# EAGLE schematic top (EAGLE 7.2.0)
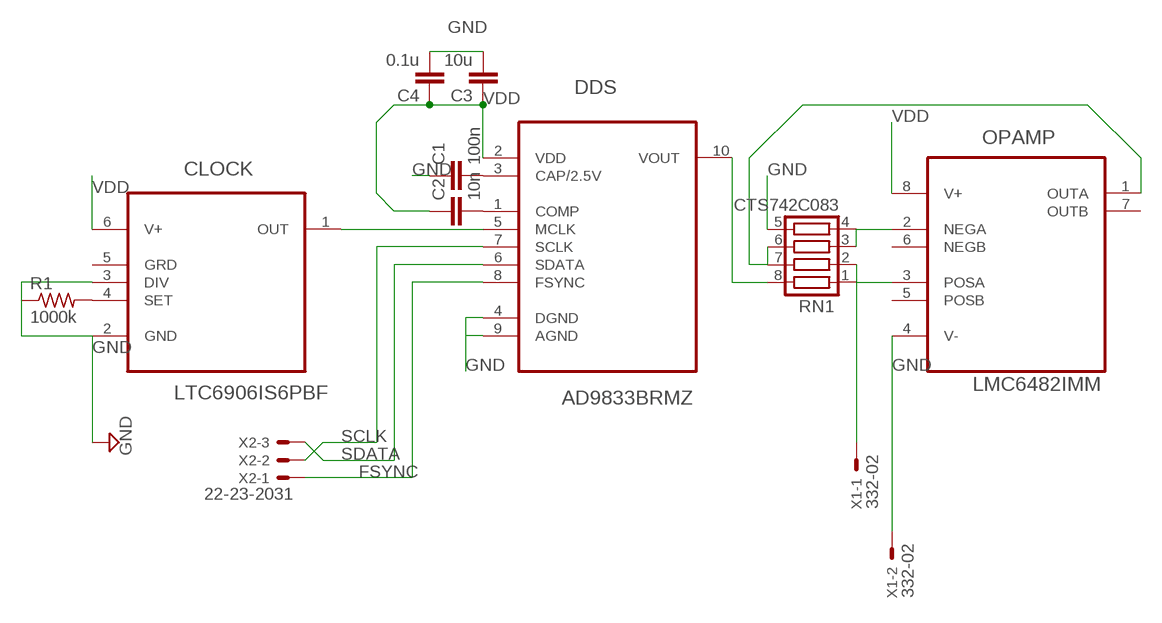
[diagram p0: schematic, sheet 1]

## Parts
C1  100n  C-EUC0805  [C0805]
C2  10n  C-EUC0805  [C0805]
C3  10u  C-EUC0805  [C0805]
C4  0.1u  C-EUC0805  [C0805]
CLOCK  LTC6906IS6PBF  [SOT95P280X100-6N]
DDS  AD9833BRMZ  [SOP50P490X110-10N]
OPAMP  LMC6482IMM  [SOP65P490X109-8N]
R1  1000k  R-US_M0805  [M0805]
RN1  CTS742C083  [CTS742C083]
X1  332-02  [332-02]
X2  22-23-2031  [22-23-2031]

## Nets
FSYNC: DDS.8(FSYNC) X2.1
GND: C1.1 C3.2 C4.2 CLOCK.2(GND) CLOCK.3(DIV) DDS.4(DGND) DDS.9(AGND) OPAMP.4(V-) R1.1 RN1.5 X1.2
N$1: C1.2 DDS.3(CAP/2.5V)
N$2: C2.2 DDS.1(COMP)
N$3: OPAMP.2(NEGA) RN1.3 RN1.4
N$4: CLOCK.1(OUT) DDS.5(MCLK)
N$5: OPAMP.3(POSA) RN1.1 RN1.2 X1.1
N$6: DDS.10(VOUT) RN1.8
N$7: OPAMP.1(OUTA) RN1.6 RN1.7
N$8: CLOCK.4(SET) R1.2
SCLK: DDS.7(SCLK) X2.2
SDATA: DDS.6(SDATA) X2.3
VDD: C2.1 C3.1 C4.1 CLOCK.6(V+) DDS.2(VDD) OPAMP.8(V+)
Unconnected: CLOCK.5(GRD) OPAMP.5(POSB) OPAMP.6(NEGB) OPAMP.7(OUTB)

## Library data of the parts
C1-C4 = resistor:C-EU: CAPACITOR, European symbol
CLOCK = LTC6906:LTC6906IS6PBF: Micropower, 10kHz to 1MHz Resistor Set Oscillator in SOT-23; MPN: LTC6906IS6#PBF; OC_FARNELL: 1432109; OC_NEWARK: 10R6975; PACKAGE: TSOT-23-6; SUPPLIER: Linear Technology
DDS = ad9833:AD9833BRMZ: Low Power 12.65 mW, 2.3 V to 5.5 V,Low Power 12.65 mW, 2.3 V to 5.5 V,Low Power 12.65 mW, 2.3 V to 5.5 V,Programmable Waveform Generator; MPN: AD9833BRMZ; OC_FARNELL: 1581966; OC_NEWARK: 19M1014; PACKAGE: MSOP-10; SUPPLIER: Analog Devices
OPAMP = LMC6482:LMC6482IMM: OpAmpIC; MPN: LMC6482IMM; OC_FARNELL: 1468890; OC_NEWARK: 83F3826; PACKAGE: MSOP-8; SUPPLIER: NationalSemiconductor
R1 = resistor:R-US_: RESISTOR, American symbol
RN1 = resistor-net:CTS742C083: Chip Resistor Array 4 Single Resistor Source: http://www.ctscorp.com/components/Datasheets/CTSChipArrayDs.pdf; OC_FARNELL: unknown; OC_NEWARK: unknown
X1 = con-garry:332-02: 2 Pin - 2mm Dual Row Source: www.mpe-connector.de / garry_shortform_2012.pdf
X2 = con-molex:22-23-2031: .100" (2.54mm) Center Header - 3 Pin; MF: MOLEX; MPN: 22-23-2031; OC_FARNELL: 1462950; OC_NEWARK: 30C0862

## Net classes
0 default: clearance 0.205 mm